# Altium schematic sheet rNET_POE_Sensor._Sheet1_RevA1.SchDoc: Sentinel Radio
size D; ApprovedBy: S. Fister; CompanyName: ECO Wireless; DrawnBy: SRF; Organization: Sentinel System, LLC; Address1: P.O. Box 18999; Address2: Tucson, AZ; Address3: 85731; Revision: X1; SheetNumber: 1; PageSetup: Record=PageOptions|CenterHorizontal=True|CenterVertical=True|PrintScale=0.52|XCorrection=1.00|YCorrection=1.00|PrintKind=0|BorderSize=5000000|LeftOffset=275|BottomOffset=0|Orientation=2|PaperLength=4318|PaperWidth=2794|Scale=100|PaperSource=7|PrintQuality=-3|MediaType=1|DitherType=10|PrintScaleMode=1|PaperKind=102 x 152 mm (4 x 6 in)|PaperIndex=158; ModifiedDate: Last Modified On
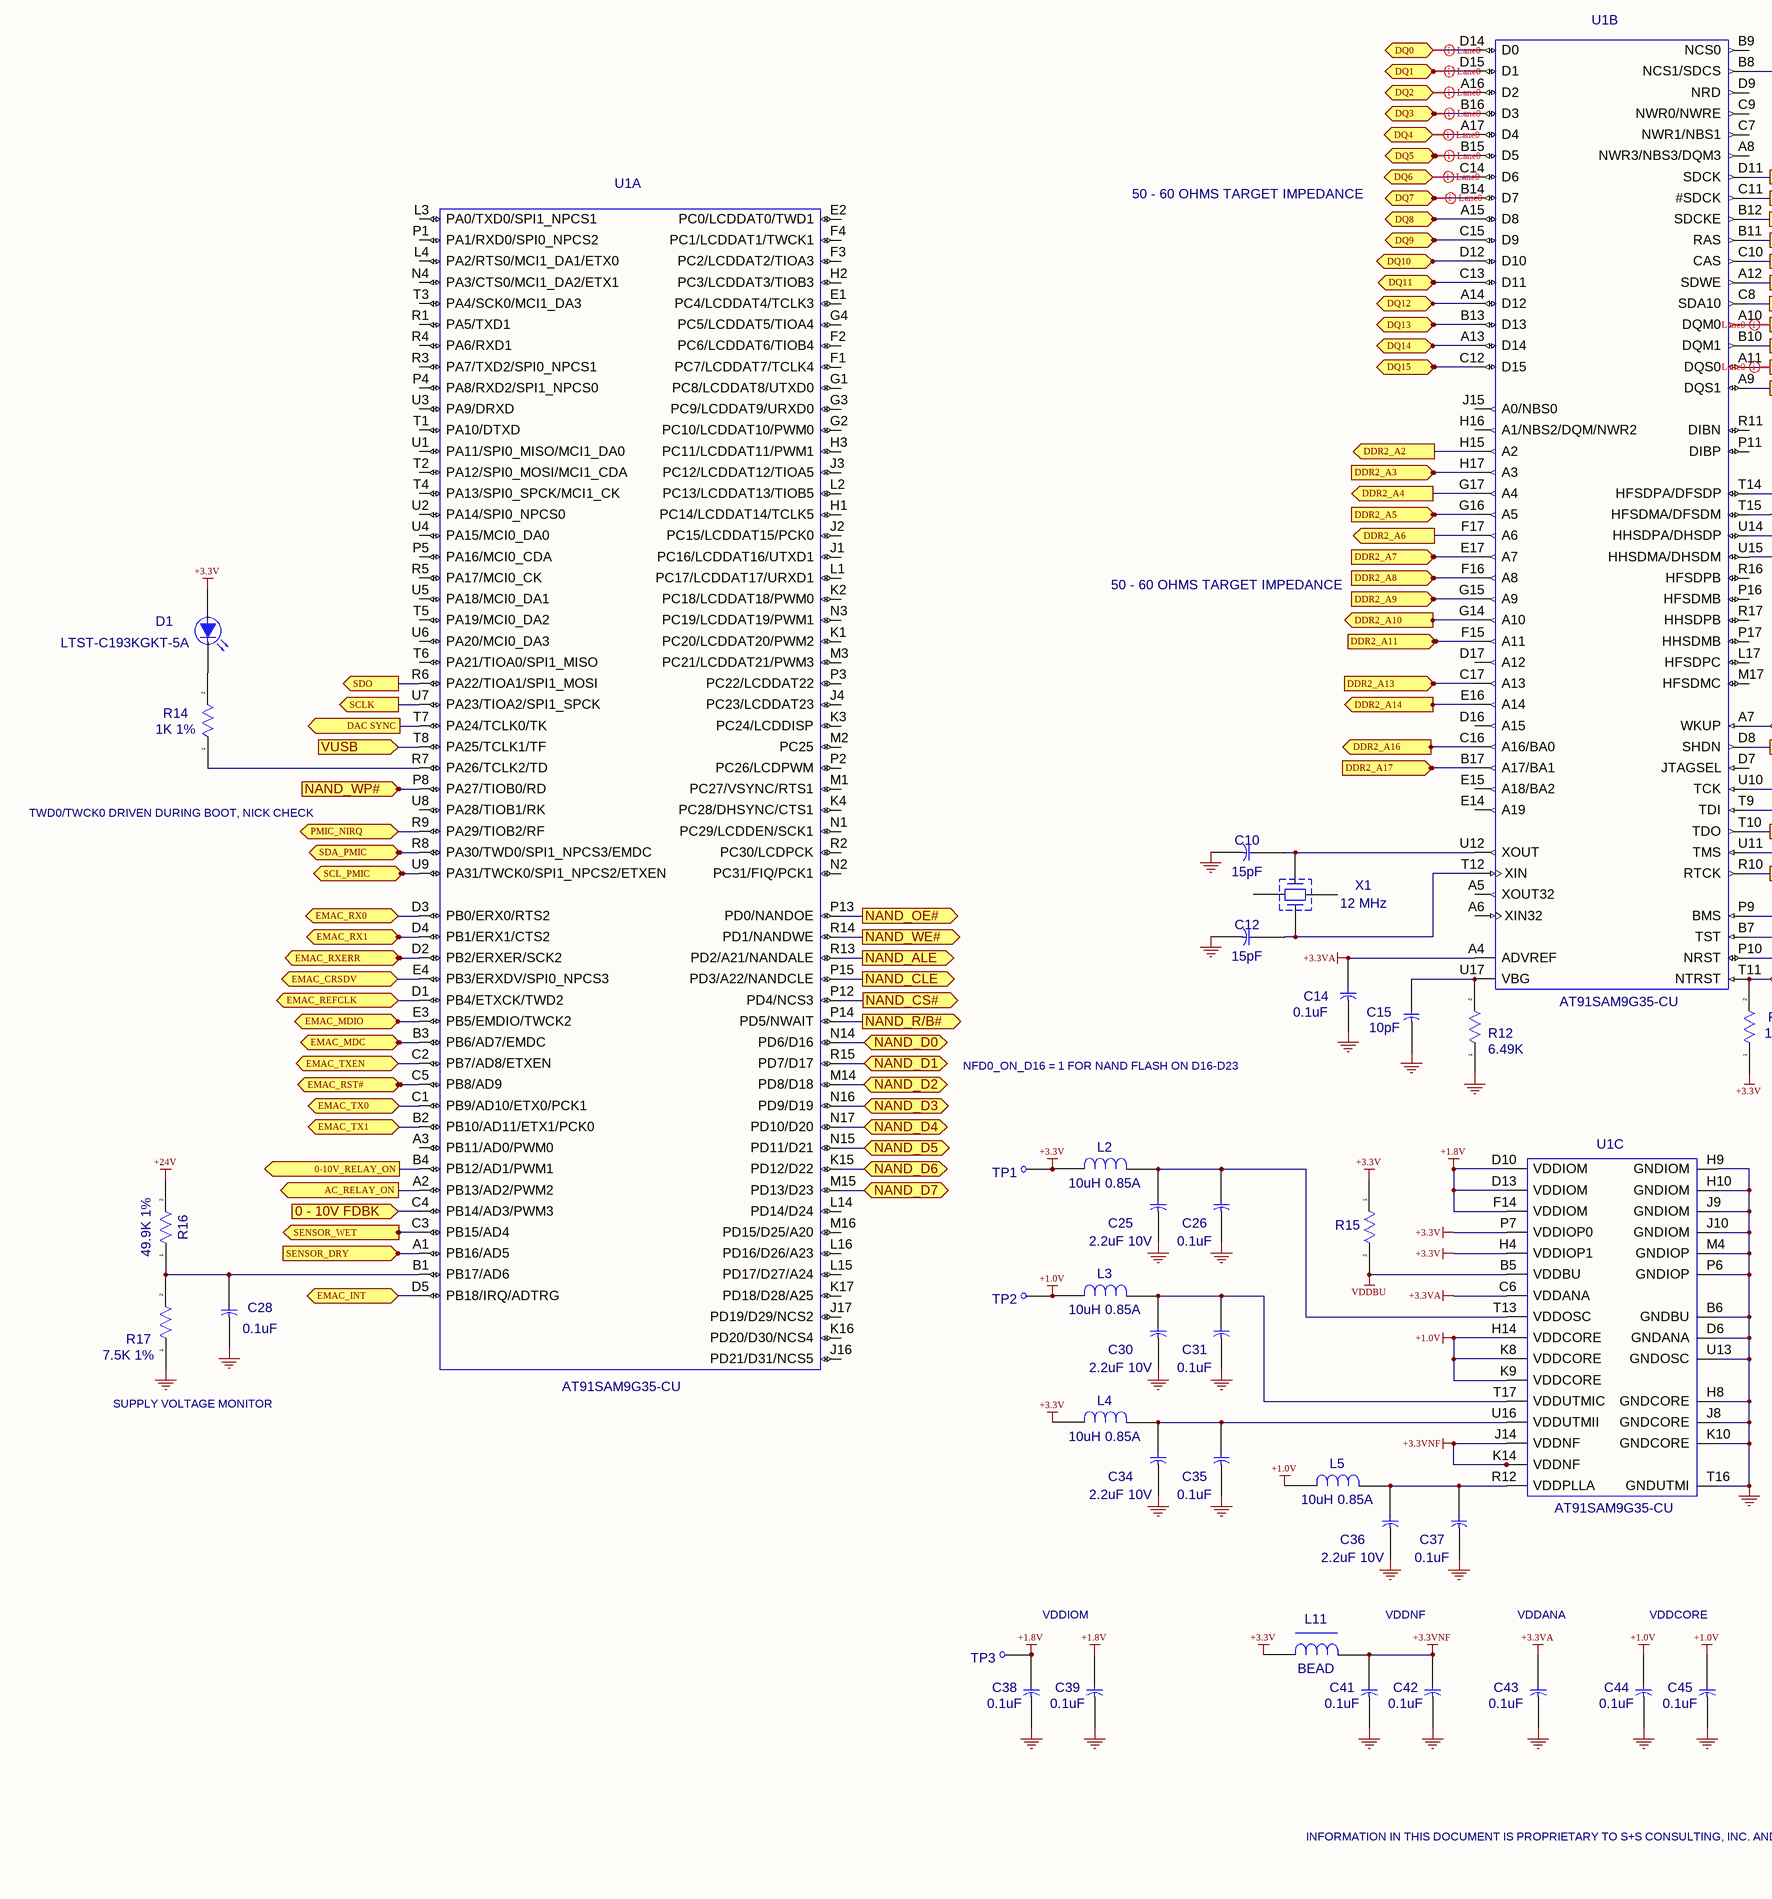
[diagram p0: rNET_POE_Sensor._Sheet1_RevA1.SchDoc, bottom left]
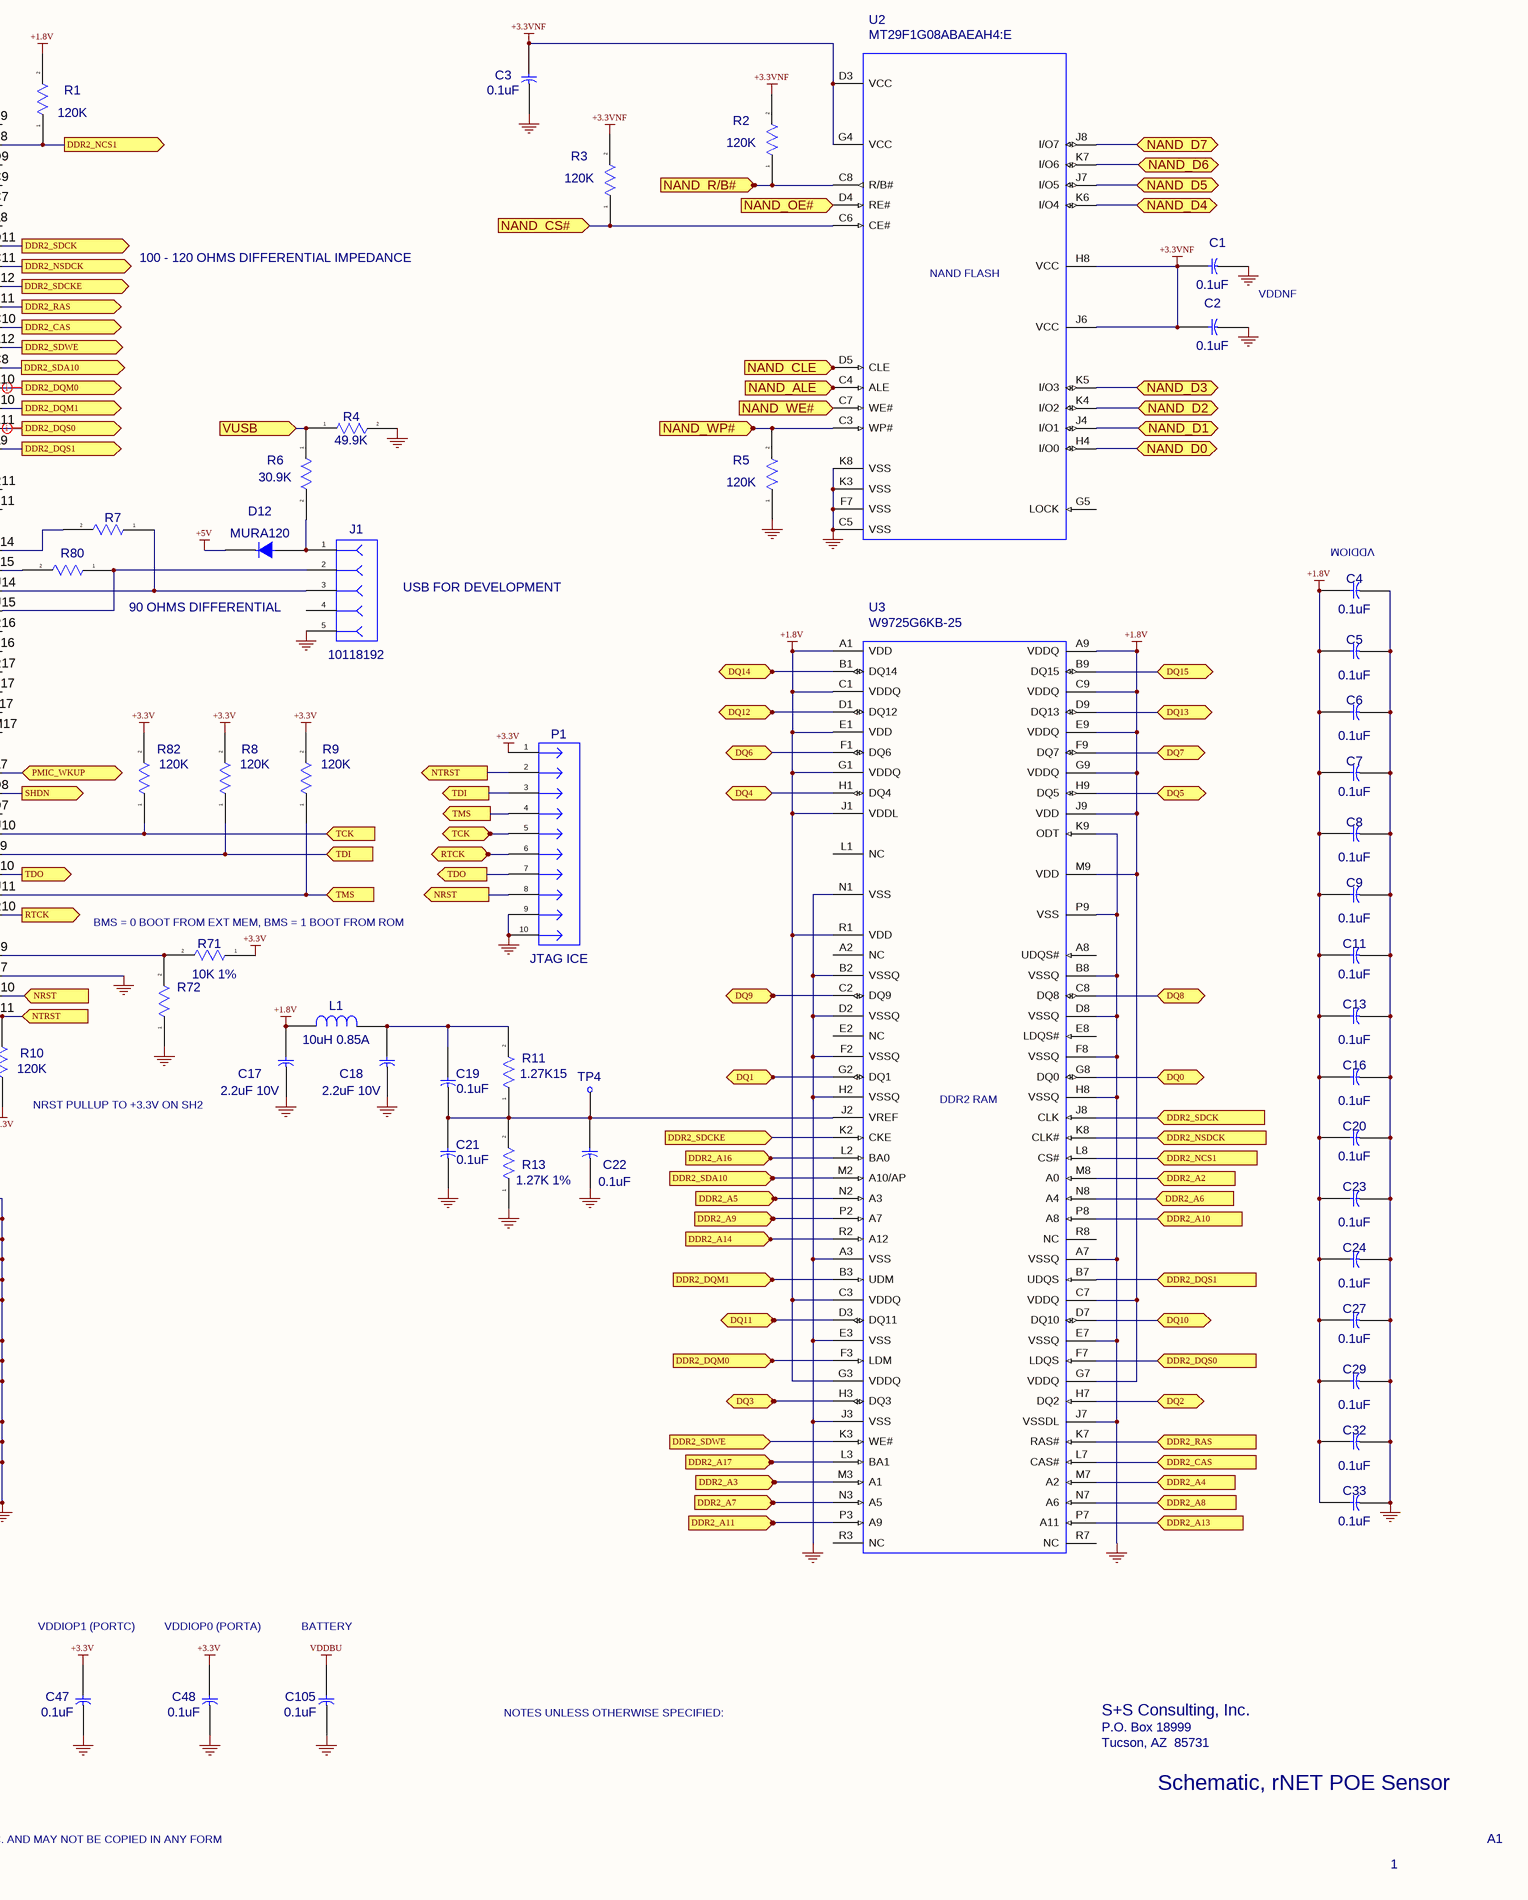
[diagram p1: rNET_POE_Sensor._Sheet1_RevA1.SchDoc, bottom right]

## Parts
C1  0.1uF  [0402NOM]
C2  0.1uF  [0402NOM]
C3  0.1uF  [0402NOM]
C4  0.1uF  [0402NOM]
C5  0.1uF  [0402NOM]
C6  0.1uF  [0402NOM]
C7  0.1uF  [0402NOM]
C8  0.1uF  [0402NOM]
C9  0.1uF  [0402NOM]
C10  15pF  [0402NOM]
C11  0.1uF  [0402NOM]
C12  15pF  [0402NOM]
C13  0.1uF  [0402NOM]
C14  0.1uF  [0402NOM]
C15  10pF  [0402NOM]
C16  0.1uF  [0402NOM]
C17  2.2uF 10V  [0402NOM]
C18  2.2uF 10V  [0402NOM]
C19  0.1uF  [0402NOM]
C20  0.1uF  [0402NOM]
C21  0.1uF  [0402NOM]
C22  0.1uF  [0402NOM]
C23  0.1uF  [0402NOM]
C24  0.1uF  [0402NOM]
C25  2.2uF 10V  [0402NOM]
C26  0.1uF  [0402NOM]
C27  0.1uF  [0402NOM]
C28  0.1uF  [0402NOM]
C29  0.1uF  [0402NOM]
C30  2.2uF 10V  [0402NOM]
C31  0.1uF  [0402NOM]
C32  0.1uF  [0402NOM]
C33  0.1uF  [0402NOM]
C34  2.2uF 10V  [0402NOM]
C35  0.1uF  [0402NOM]
C36  2.2uF 10V  [0402NOM]
C37  0.1uF  [0402NOM]
C38  0.1uF  [0402NOM]
C39  0.1uF  [0402NOM]
C41  0.1uF  [0402NOM]
C42  0.1uF  [0402NOM]
C43  0.1uF  [0402NOM]
C44  0.1uF  [0402NOM]
C45  0.1uF  [0402NOM]
C47  0.1uF  [0402NOM]
C48  0.1uF  [0402NOM]
C105  0.1uF  [0402NOM]
D1  LTST-C193KGKT-5A  [0603_POL]
D12  MURA120  [SMAPWR]
J1  10118192  [USB_MICROB_AMPHENOL_10118192-0001LF]
L1  10uH 0.85A  [1008]
L2  10uH 0.85A  [1008]
L3  10uH 0.85A  [1008]
L4  10uH 0.85A  [1008]
L5  10uH 0.85A  [1008]
L11  BEAD  [0402NOM]
P1  JTAG ICE  [HEADER2X5D50]
R1  120K  [0402NOM]
R2  120K  [0402NOM]
R3  120K  [0402NOM]
R4  49.9K  [0402NOM]
R5  120K  [0402NOM]
R6  30.9K  [0402NOM]
R7  39  [0402NOM]  (value not drawn)
R8  120K  [0402NOM]
R9  120K  [0402NOM]
R10  120K  [0402NOM]
R11  1.27K15  [0402NOM]
R12  6.49K  [0402NOM]
R13  1.27K 1%  [0402NOM]
R14  1K 1%  [0402NOM]
R15  0  [0402NOM]  (value not drawn)
R16  49.9K 1%  [0402NOM]
R17  7.5K 1%  [0402NOM]
R71  10K 1%  [0402NOM]
R72  49.9  [0402NOM]  (value not drawn)
R80  39  [0402NOM]  (value not drawn)
R82  120K  [0402NOM]
TP1  +3.3V  [TESTPOINTTOPD25]  (value not drawn)
TP2  +1.0V  [TESTPOINTTOPD25]  (value not drawn)
TP3  +1.8V  [TESTPOINTTOPD25]  (value not drawn)
TP4  VREF  [TESTPOINTTOPD25]  (value not drawn)
U1  AT91SAM9G35-CU  [BGA217_17x17]  (parts A,B,C of 3)
U2  MT29F1G08ABAEAH4:E  [VFBGA63]
U3  W9725G6KB-25  [WBGA84]
X1  12 MHz  [XTALABMM2]

## Ports
0 - 10V FDBK (in), 0-10V_RELAY_ON (out), AC_RELAY_ON (out), DAC SYNC (out), DDR2_A2 (in), DDR2_A2 (out), DDR2_A3 (in), DDR2_A3 (out), DDR2_A4 (in), DDR2_A4 (out), DDR2_A5 (in), DDR2_A5 (out), DDR2_A6 (in), DDR2_A6 (out), DDR2_A7 (in), DDR2_A7 (out), DDR2_A8 (in), DDR2_A8 (out), DDR2_A9 (in), DDR2_A9 (out), DDR2_A10 (in), DDR2_A10 (out), DDR2_A11 (in), DDR2_A11 (out), DDR2_A13 (in), DDR2_A13 (out), DDR2_A14 (in), DDR2_A14 (out), DDR2_A16 (in), DDR2_A16 (out), DDR2_A17 (in), DDR2_A17 (out), DDR2_CAS (in), DDR2_CAS (out), DDR2_DQM0 (in), DDR2_DQM0 (out), DDR2_DQM1 (in), DDR2_DQM1 (out), DDR2_DQS0 (in), DDR2_DQS0 (out), DDR2_DQS1 (in), DDR2_DQS1 (out), DDR2_NCS1 (in), DDR2_NCS1 (out), DDR2_NSDCK (in), DDR2_NSDCK (out), DDR2_RAS (in), DDR2_RAS (out), DDR2_SDA10 (in), DDR2_SDA10 (out), DDR2_SDCK (in), DDR2_SDCK (out), DDR2_SDCKE (in), DDR2_SDCKE (out), DDR2_SDWE (in), DDR2_SDWE (out), DQ0 (bidir), DQ1 (bidir), DQ2 (bidir), DQ3 (bidir), DQ4 (bidir), DQ5 (bidir), DQ6 (bidir), DQ7 (bidir), DQ8 (bidir), DQ9 (bidir), DQ10 (bidir), DQ11 (bidir), DQ12 (bidir), DQ13 (bidir), DQ14 (bidir), DQ15 (bidir), EMAC_CRSDV (bidir), EMAC_INT (bidir), EMAC_MDC (bidir), EMAC_MDIO (bidir), EMAC_REFCLK (bidir), EMAC_RST# (bidir), EMAC_RX0 (bidir), EMAC_RX1 (bidir), EMAC_RXERR (bidir), EMAC_TX0 (bidir), EMAC_TX1 (bidir), EMAC_TXEN (bidir), NAND_ALE (in), NAND_ALE (out), NAND_CLE (in), NAND_CLE (out), NAND_CS# (in), NAND_CS# (out), NAND_D0 (bidir), NAND_D1 (bidir), NAND_D2 (bidir), NAND_D3 (bidir), NAND_D4 (bidir), NAND_D5 (bidir), NAND_D6 (bidir), NAND_D7 (bidir), NAND_OE# (in), NAND_OE# (out), NAND_R/B# (in), NAND_R/B# (out), NAND_WE# (in), NAND_WE# (out), NAND_WP# (in), NAND_WP# (out), NRST (in), NRST (out), NTRST (in), NTRST (out), PMIC_NIRQ (bidir), PMIC_WKUP (bidir), RTCK (in), RTCK (out), SCL_PMIC (bidir), SCLK (out), SDA_PMIC (bidir), SDO (out), SENSOR_DRY (in), SENSOR_WET (in), SHDN (out), TCK (in), TCK (out), TDI (in), TDI (out), TDO (out), TMS (in), TMS (out), VUSB

## Nets
+1.0V: C44.2 C45.2 L3.2 L5.2 TP2.1 U1.H14(VDDCORE) U1.K8(VDDCORE) U1.K9(VDDCORE)
+1.8V: C4.2 C5.2 C6.2 C7.2 C8.2 C9.2 C11.2 C13.2 C16.2 C17.2 C20.2 C23.2 C24.2 C27.2 C29.2 C32.2 C33.2 C38.2 C39.2 L1.2 R1.2 TP3.1 U1.D10(VDDIOM) U1.D13(VDDIOM) U1.F14(VDDIOM) U3.A1(VDD) U3.A9(VDDQ) U3.C1(VDDQ) U3.C3(VDDQ) U3.C7(VDDQ) U3.C9(VDDQ) U3.E1(VDD) U3.E9(VDDQ) U3.G1(VDDQ) U3.G3(VDDQ) U3.G7(VDDQ) U3.G9(VDDQ) U3.J1(VDDL) U3.J9(VDD) U3.M9(VDD) U3.R1(VDD)
+3.3V: C47.2 C48.2 D1.2(A) L2.2 L4.2 L11.2 P1.1 R8.2 R9.2 R10.1 R15.1 R71.1 R82.2 TP1.1 U1.H4(VDDIOP1) U1.P7(VDDIOP0)
+3.3VA: C14.2 C43.2 U1.A4(ADVREF) U1.C6(VDDANA)
+3.3VNF: C1.2 C2.2 C3.2 C41.2 C42.2 L11.1 R2.2 R3.2 U1.J14(VDDNF) U1.K14(VDDNF) U2.D3(VCC) U2.G4(VCC) U2.H8(VCC) U2.J6(VCC)
+5V: D12.2(C)
+24V: R16.2
GND: C1.1 C2.1 C3.1 C4.1 C5.1 C6.1 C7.1 C8.1 C9.1 C10.1 C11.1 C12.1 C13.1 C14.1 C15.1 C16.1 C17.1 C18.1 C20.1 C21.1 C22.1 C23.1 C24.1 C25.1 C26.1 C27.1 C28.1 C29.1 C30.1 C31.1 C32.1 C33.1 C34.1 C35.1 C36.1 C37.1 C38.1 C39.1 C41.1 C42.1 C43.1 C44.1 C45.1 C47.1 C48.1 C105.1 J1.5 P1.9 P1.10 R4.2 R5.1 R12.1 R13.1 R17.1 R72.1 U1.B6(GNDBU) U1.B7(TST) U1.D6(GNDANA) U1.H8(GNDCORE) U1.H9(GNDIOM) U1.H10(GNDIOM) U1.J8(GNDCORE) U1.J9(GNDIOM) U1.J10(GNDIOM) U1.K10(GNDCORE) U1.M4(GNDIOP) U1.P6(GNDIOP) U1.T16(GNDUTMI) U1.U13(GNDOSC) U2.C5(VSS) U2.F7(VSS) U2.K3(VSS) U2.K8(VSS) U3.A3(VSS) U3.A7(VSSQ) U3.B2(VSSQ) U3.B8(VSSQ) U3.D2(VSSQ) U3.D8(VSSQ) U3.E3(VSS) U3.E7(VSSQ) U3.F2(VSSQ) U3.F8(VSSQ) U3.H2(VSSQ) U3.H8(VSSQ) U3.J3(VSS) U3.J7(VSSDL) U3.K9(ODT) U3.N1(VSS) U3.P9(VSS)
VDDBU: C105.2 R15.2 U1.B5(VDDBU)
0 - 10V FDBK: U1.C4(PB14/AD3/PWM3) ; port 0 - 10V FDBK
0-10V_RELAY_ON: U1.B4(PB12/AD1/PWM1) ; port 0-10V_RELAY_ON
AC_RELAY_ON: U1.A2(PB13/AD2/PWM2) ; port AC_RELAY_ON
DAC SYNC: U1.T7(PA24/TCLK0/TK) ; port DAC SYNC
DDR2_A2: U1.H15(A2) U3.M8(A0) ; port DDR2_A2
DDR2_A3: U1.H17(A3) U3.M3(A1) ; port DDR2_A3
DDR2_A4: U1.G17(A4) U3.M7(A2) ; port DDR2_A4
DDR2_A5: U1.G16(A5) U3.N2(A3) ; port DDR2_A5
DDR2_A6: U1.F17(A6) U3.N8(A4) ; port DDR2_A6
DDR2_A7: U1.E17(A7) U3.N3(A5) ; port DDR2_A7
DDR2_A8: U1.F16(A8) U3.N7(A6) ; port DDR2_A8
DDR2_A9: U1.G15(A9) U3.P2(A7) ; port DDR2_A9
DDR2_A10: U1.G14(A10) U3.P8(A8) ; port DDR2_A10
DDR2_A11: U1.F15(A11) U3.P3(A9) ; port DDR2_A11
DDR2_A13: U1.C17(A13) U3.P7(A11) ; port DDR2_A13
DDR2_A14: U1.E16(A14) U3.R2(A12) ; port DDR2_A14
DDR2_A16: U1.C16(A16/BA0) U3.L2(BA0) ; port DDR2_A16
DDR2_A17: U1.B17(A17/BA1) U3.L3(BA1) ; port DDR2_A17
DDR2_CAS: U1.C10(CAS) U3.L7(CAS#) ; port DDR2_CAS
DDR2_DQM0: U1.A10(DQM0) U3.F3(LDM) ; port DDR2_DQM0
DDR2_DQM1: U1.B10(DQM1) U3.B3(UDM) ; port DDR2_DQM1
DDR2_DQS0: U1.A11(DQS0) U3.F7(LDQS) ; port DDR2_DQS0
DDR2_DQS1: U1.A9(DQS1) U3.B7(UDQS) ; port DDR2_DQS1
DDR2_NCS1: R1.1 U1.B8(NCS1/SDCS) U3.L8(CS#) ; port DDR2_NCS1
DDR2_NSDCK: U1.C11(#SDCK) U3.K8(CLK#) ; port DDR2_NSDCK
DDR2_RAS: U1.B11(RAS) U3.K7(RAS#) ; port DDR2_RAS
DDR2_SDA10: U1.C8(SDA10) U3.M2(A10/AP) ; port DDR2_SDA10
DDR2_SDCK: U1.D11(SDCK) U3.J8(CLK) ; port DDR2_SDCK
DDR2_SDCKE: U1.B12(SDCKE) U3.K2(CKE) ; port DDR2_SDCKE
DDR2_SDWE: U1.A12(SDWE) U3.K3(WE#) ; port DDR2_SDWE
DQ0: U1.D14(D0) U3.G8(DQ0) ; port DQ0
DQ1: U1.D15(D1) U3.G2(DQ1) ; port DQ1
DQ2: U1.A16(D2) U3.H7(DQ2) ; port DQ2
DQ3: U1.B16(D3) U3.H3(DQ3) ; port DQ3
DQ4: U1.A17(D4) U3.H1(DQ4) ; port DQ4
DQ5: U1.B15(D5) U3.H9(DQ5) ; port DQ5
DQ6: U1.C14(D6) U3.F1(DQ6) ; port DQ6
DQ7: U1.B14(D7) U3.F9(DQ7) ; port DQ7
DQ8: U1.A15(D8) U3.C8(DQ8) ; port DQ8
DQ9: U1.C15(D9) U3.C2(DQ9) ; port DQ9
DQ10: U1.D12(D10) U3.D7(DQ10) ; port DQ10
DQ11: U1.C13(D11) U3.D3(DQ11) ; port DQ11
DQ12: U1.A14(D12) U3.D1(DQ12) ; port DQ12
DQ13: U1.B13(D13) U3.D9(DQ13) ; port DQ13
DQ14: U1.A13(D14) U3.B1(DQ14) ; port DQ14
DQ15: U1.C12(D15) U3.B9(DQ15) ; port DQ15
EMAC_CRSDV: U1.E4(PB3/ERXDV/SPI0_NPCS3) ; port EMAC_CRSDV
EMAC_INT: U1.D5(PB18/IRQ/ADTRG) ; port EMAC_INT
EMAC_MDC: U1.B3(PB6/AD7/EMDC) ; port EMAC_MDC
EMAC_MDIO: U1.E3(PB5/EMDIO/TWCK2) ; port EMAC_MDIO
EMAC_REFCLK: U1.D1(PB4/ETXCK/TWD2) ; port EMAC_REFCLK
EMAC_RST#: U1.C5(PB8/AD9) ; port EMAC_RST#
EMAC_RX0: U1.D3(PB0/ERX0/RTS2) ; port EMAC_RX0
EMAC_RX1: U1.D4(PB1/ERX1/CTS2) ; port EMAC_RX1
EMAC_RXERR: U1.D2(PB2/ERXER/SCK2) ; port EMAC_RXERR
EMAC_TX0: U1.C1(PB9/AD10/ETX0/PCK1) ; port EMAC_TX0
EMAC_TX1: U1.B2(PB10/AD11/ETX1/PCK0) ; port EMAC_TX1
EMAC_TXEN: U1.C2(PB7/AD8/ETXEN) ; port EMAC_TXEN
NAND_ALE: U1.R13(PD2/A21/NANDALE) U2.C4(ALE) ; port NAND_ALE
NAND_CLE: U1.P15(PD3/A22/NANDCLE) U2.D5(CLE) ; port NAND_CLE
NAND_CS#: R3.1 U1.P12(PD4/NCS3) U2.C6(CE#) ; port NAND_CS#
NAND_D0: U1.N14(PD6/D16) U2.H4(I/O0) ; port NAND_D0
NAND_D1: U1.R15(PD7/D17) U2.J4(I/O1) ; port NAND_D1
NAND_D2: U1.M14(PD8/D18) U2.K4(I/O2) ; port NAND_D2
NAND_D3: U1.N16(PD9/D19) U2.K5(I/O3) ; port NAND_D3
NAND_D4: U1.N17(PD10/D20) U2.K6(I/O4) ; port NAND_D4
NAND_D5: U1.N15(PD11/D21) U2.J7(I/O5) ; port NAND_D5
NAND_D6: U1.K15(PD12/D22) U2.K7(I/O6) ; port NAND_D6
NAND_D7: U1.M15(PD13/D23) U2.J8(I/O7) ; port NAND_D7
NAND_OE#: U1.P13(PD0/NANDOE) U2.D4(RE#) ; port NAND_OE#
NAND_R/B#: R2.1 U1.P14(PD5/NWAIT) U2.C8(R/B#) ; port NAND_R/B#
NAND_WE#: U1.R14(PD1/NANDWE) U2.C7(WE#) ; port NAND_WE#
NAND_WP#: R5.2 U1.P8(PA27/TIOB0/RD) U2.C3(WP#) ; port NAND_WP#
NRST: P1.8 U1.P10(NRST) ; port NRST
NTRST: P1.2 R10.2 U1.T11(NTRST) ; port NTRST
PMIC_NIRQ: U1.R9(PA29/TIOB2/RF) ; port PMIC_NIRQ
PMIC_WKUP: U1.A7(WKUP) ; port PMIC_WKUP
RTCK: P1.6 U1.R10(RTCK) ; port RTCK
SCL_PMIC: U1.U9(PA31/TWCK0/SPI1_NPCS2/ETXEN) ; port SCL_PMIC
SCLK: U1.U7(PA23/TIOA2/SPI1_SPCK) ; port SCLK
SDA_PMIC: U1.R8(PA30/TWD0/SPI1_NPCS3/EMDC) ; port SDA_PMIC
SDO: U1.R6(PA22/TIOA1/SPI1_MOSI) ; port SDO
SENSOR_DRY: U1.A1(PB16/AD5) ; port SENSOR_DRY
SENSOR_WET: U1.C3(PB15/AD4) ; port SENSOR_WET
SHDN: U1.D8(SHDN) ; port SHDN
TCK: P1.5 R82.1 U1.U10(TCK) ; port TCK
TDI: P1.3 R8.1 U1.T9(TDI) ; port TDI
TDO: P1.7 U1.T10(TDO) ; port TDO
TMS: P1.4 R9.1 U1.U11(TMS) ; port TMS
VUSB: R4.1 R6.1 U1.T8(PA25/TCLK1/TF) ; port VUSB
NetC10_2: C10.2 U1.U12(XOUT) X1.1
NetC12_2: C12.2 U1.T12(XIN) X1.3
NetC15_2: C15.2 R12.2 U1.U17(VBG)
NetC18_2: C18.2 C19.2 L1.1 R11.2
NetC19_1: C19.1 C21.2 C22.2 R11.1 R13.2 TP4.1 U3.J2(VREF)
NetC25_2: C25.2 C26.2 L2.1 U1.T13(VDDOSC)
NetC28_2: C28.2 R16.1 R17.2 U1.B1(PB17/AD6)
NetC30_2: C30.2 C31.2 L3.1 U1.T17(VDDUTMIC)
NetC34_2: C34.2 C35.2 L4.1 U1.U16(VDDUTMII)
NetC36_2: C36.2 C37.2 L5.1 U1.R12(VDDPLLA)
NetD1_1: D1.1(C) R14.2
NetD12_1: D12.1(A) J1.1 R6.2
NetJ1_2: J1.2 R80.1 U1.U15(HHSDMA/DHSDM)
NetJ1_3: J1.3 R7.1 U1.U14(HHSDPA/DHSDP)
NetR7_2: R7.2 U1.T14(HFSDPA/DFSDP)
NetR14_1: R14.1 U1.R7(PA26/TCLK2/TD)
NetR71_2: R71.2 R72.2 U1.P9(BMS)
NetR80_2: R80.2 U1.T15(HFSDMA/DFSDM)

Not connected (* = marked no-connect by the designer): J1 4 9 10 11 12; U1 A3(PB11/AD0/PWM0) A5(XOUT32) A6(XIN32) A8(NWR3/NBS3/DQM3) B9(NCS0) C7(NWR1/NBS1) C9(NWR0/NWRE) D7(JTAGSEL) D9(NRD) D16(A15) D17(A12) E1(PC4/LCDDAT4/TCLK3) E2(PC0/LCDDAT0/TWD1) E14(A19) E15(A18/BA2) F1(PC7/LCDDAT7/TCLK4) F2(PC6/LCDDAT6/TIOB4) F3(PC2/LCDDAT2/TIOA3) F4(PC1/LCDDAT1/TWCK1) G1(PC8/LCDDAT8/UTXD0) G2(PC10/LCDDAT10/PWM0) G3(PC9/LCDDAT9/URXD0) G4(PC5/LCDDAT5/TIOA4) H1(PC14/LCDDAT14/TCLK5) H2(PC3/LCDDAT3/TIOB3) H3(PC11/LCDDAT11/PWM1) H16(A1/NBS2/DQM/NWR2) J1(PC16/LCDDAT16/UTXD1) J2(PC15/LCDDAT15/PCK0) J3(PC12/LCDDAT12/TIOA5) J4(PC23/LCDDAT23) J15(A0/NBS0) J16(PD21/D31/NCS5) J17(PD19/D29/NCS2) K1(PC20/LCDDAT20/PWM2) K2(PC18/LCDDAT18/PWM0) K3(PC24/LCDDISP) K4(PC28/DHSYNC/CTS1) K16(PD20/D30/NCS4) K17(PD18/D28/A25) L1(PC17/LCDDAT17/URXD1) L2(PC13/LCDDAT13/TIOB5) L3(PA0/TXD0/SPI1_NPCS1) L4(PA2/RTS0/MCI1_DA1/ETX0) L14(PD14/D24) L15(PD17/D27/A24) L16(PD16/D26/A23) L17(HFSDPC) M1(PC27/VSYNC/RTS1) M2(PC25) M3(PC21/LCDDAT21/PWM3) M16(PD15/D25/A20) M17(HFSDMC) N1(PC29/LCDDEN/SCK1) N2(PC31/FIQ/PCK1) N3(PC19/LCDDAT19/PWM1) N4(PA3/CTS0/MCI1_DA2/ETX1) P1(PA1/RXD0/SPI0_NPCS2) P2(PC26/LCDPWM) P3(PC22/LCDDAT22) P4(PA8/RXD2/SPI1_NPCS0) P5(PA16/MCI0_CDA) P11(DIBP) P16(HFSDMB) P17(HHSDMB) R1(PA5/TXD1) R2(PC30/LCDPCK) R3(PA7/TXD2/SPI0_NPCS1) R4(PA6/RXD1) R5(PA17/MCI0_CK) R11(DIBN) R16(HFSDPB) R17(HHSDPB) T1(PA10/DTXD) T2(PA12/SPI0_MOSI/MCI1_CDA) T3(PA4/SCK0/MCI1_DA3) T4(PA13/SPI0_SPCK/MCI1_CK) T5(PA19/MCI0_DA2) T6(PA21/TIOA0/SPI1_MISO) U1(PA11/SPI0_MISO/MCI1_DA0) U2(PA14/SPI0_NPCS0) U3(PA9/DRXD) U4(PA15/MCI0_DA0) U5(PA18/MCI0_DA1) U6(PA20/MCI0_DA3) U8(PA28/TIOB1/RK); U2 G5(LOCK); U3 A2(NC) A8(UDQS#) E2(NC) E8(LDQS#) L1(NC) R3(NC) R7(NC) R8(NC); X1 2 4

## Layout directives
net class Undefined: DDR2_DQM0, DDR2_DQS0, DQ0, DQ1, DQ2, DQ3, DQ4, DQ5, DQ6, DQ7

## Notes on the sheet
- 50 - 60 OHMS TARGET IMPEDANCE
- 100 - 120 OHMS DIFFERENTIAL IMPEDANCE
- (near U2) NAND FLASH
- VDDNF
- (near C4) VDDIOM
- 90 OHMS DIFFERENTIAL
- USB FOR DEVELOPMENT
- TWD0/TWCK0 DRIVEN DURING BOOT, NICK CHECK
- (near R71) BMS = 0 BOOT FROM EXT MEM, BMS = 1 BOOT FROM ROM
- NFD0_ON_D16 = 1 FOR NAND FLASH ON D16-D23
- (near R10) NRST PULLUP TO +3.3V ON SH2
- (near U3) DDR2 RAM
- SUPPLY VOLTAGE MONITOR
- VDDIOM
- VDDANA
- VDDCORE
- VDDIOP1 (PORTC)
- VDDIOP0 (PORTA)
- BATTERY
- NOTES UNLESS OTHERWISE SPECIFIED:
- S+S Consulting, Inc.
- P.O. Box 18999
- Tucson, AZ  85731
- Schematic, rNET POE Sensor
- INFORMATION IN THIS DOCUMENT IS PROPRIETARY TO S+S CONSULTING, INC. AND MAY NOT BE COPIED IN ANY FORM
- 1
- A1

## Library data of the parts
C1-C39 C41-C45 C47 C48 C105 = CCAP0402: Value: {Value}; Part Number: CCAP0402
D1 = LED_0603_C1A2: Value: {Value}; Part Number: LED_0603_C1A2
D12 = DIODESMAPWR: Value: {Value}; Part Number: DIODESMAPWR
J1 = USB_MICROB_AMPHENOL_10118192-0001LF: Value: {Value}; Part Number: USB_MICROB_AMPHENOL_10118192-0001LF
L1-L5 = IND1008: Value: {Value}; Part Number: IND1008
L11 = FERRITE0402: Value: {Value}; Part Number: FERRITE0402
P1 = HEADER2X5D50: Part Number: HEADER2X5D50; Value: *
R1-R17 R71 R72 R80 R82 = RRES0402: Value: {Value}; Part Number: RRES0402
TP1-TP4 = TESTPOINTTOPD25: Part Number: TESTPOINTTOPD25; Value: *
X1 = XTALABMM2: Value: {Value}; Part Number: XTALABMM2
U1 = AT91SAM9G35-CU: DatasheetVersion: revB, Sep-2011; PackageVersion: 2011; PackageReference: LFBGA217; PackageDescription: 217-Ball Plastic Low Profile Fine-Pitch BGA, 15 x 15 mm Body, 0.8 mm Pitch; Code_JEDEC: MO-205; ComponentLink1Description: Manufacturer URL; ComponentLink1URL: http://www.atmel.com/; ComponentLink2Description: SAM9G35 Datasheet; ComponentLink2URL: http://www.atmel.com/dyn/resources/prod_documents/doc11053.pdf; ComponentLink3Description: SAM9G35 Summary; ComponentLink3URL: http://www.atmel.com/dyn/resources/prod_documents/11053s.pdf; Part Number: AT91SAM9G35-CU; Value: *
U2 = MT29F1G08ABAEAH4:E: Part Number: MT29F1G08ABAEAH4:E; Value: *
U3 = W9725G6KB-25: Part Number: W9725G6KB-25; Value: *